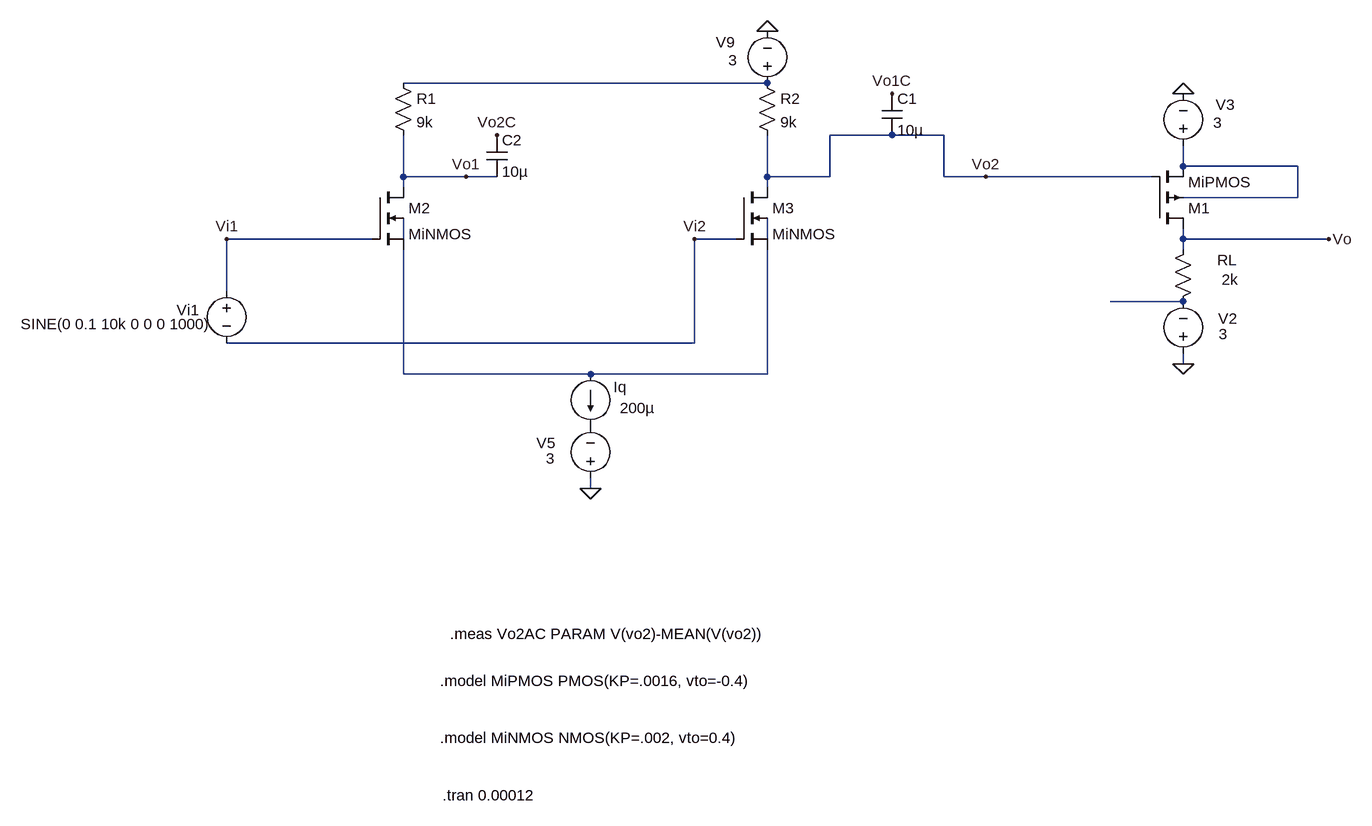
[diagram p0: schematic Draft1.asc]
Draft1.asc, the LTspice schematic file:
Version 4
SHEET 1 3032 1048
WIRE 2096 -64 1536 -64
WIRE 2288 16 2192 16
WIRE 2368 16 2288 16
WIRE 2736 64 2736 32
WIRE 2912 64 2736 64
WIRE 1536 80 1536 16
WIRE 1632 80 1536 80
WIRE 1680 80 1632 80
WIRE 2096 80 2096 16
WIRE 2192 80 2192 16
WIRE 2192 80 2096 80
WIRE 2368 80 2368 16
WIRE 2432 80 2368 80
WIRE 2688 80 2432 80
WIRE 1536 96 1536 80
WIRE 2096 96 2096 80
WIRE 2912 112 2912 64
WIRE 2912 112 2736 112
WIRE 1488 176 1264 176
WIRE 1536 176 1536 144
WIRE 2048 176 1984 176
WIRE 2096 176 2096 144
WIRE 2736 176 2736 160
WIRE 2960 176 2736 176
WIRE 2736 192 2736 176
WIRE 1264 256 1264 176
WIRE 2736 272 2624 272
WIRE 1984 336 1984 176
WIRE 1984 336 1264 336
WIRE 2736 368 2736 352
WIRE 1536 384 1536 192
WIRE 1824 384 1536 384
WIRE 2096 384 2096 192
WIRE 2096 384 1824 384
WIRE 1824 560 1824 544
FLAG 2736 368 0
FLAG 2736 -48 0
FLAG 1824 560 0
FLAG 2096 -144 0
FLAG 1632 80 Vo1
FLAG 2432 80 Vo2
FLAG 2960 176 Vo
FLAG 1984 176 Vi2
FLAG 1264 176 Vi1
FLAG 2288 -48 Vo1C
FLAG 1680 16 Vo2C
DATAFLAG 2640 272 ""
DATAFLAG 1392 176 ""
DATAFLAG 1664 384 ""
SYMBOL voltage 2736 368 M180
WINDOW 0 54 70 Left 2
WINDOW 3 55 46 Left 2
SYMATTR InstName V2
SYMATTR Value 3
SYMBOL res 2752 176 M0
WINDOW 0 -67 32 Left 2
WINDOW 3 -69 62 Left 2
SYMATTR InstName RL
SYMATTR Value 2k
SYMBOL voltage 2736 48 M180
WINDOW 0 50 79 Left 2
WINDOW 3 46 51 Left 2
SYMATTR InstName V3
SYMATTR Value 3
SYMBOL pmos4 2688 160 M180
SYMATTR InstName M1
SYMATTR Value MiPMOS
SYMBOL voltage 1264 240 R0
WINDOW 0 -77 45 Left 2
WINDOW 3 -317 67 Left 2
WINDOW 123 0 0 Left 0
WINDOW 39 0 0 Left 0
SYMATTR InstName Vi1
SYMATTR Value SINE(0 0.1 10k 0 0 0 1000)
SYMBOL voltage 1824 560 R180
WINDOW 0 54 70 Left 2
WINDOW 3 55 46 Left 2
SYMATTR InstName V5
SYMATTR Value 3
SYMBOL nmos4 1488 96 R0
SYMATTR InstName M2
SYMATTR Value MiNMOS
SYMBOL current 1824 384 R0
WINDOW 0 35 20 Left 2
WINDOW 3 45 52 Left 2
WINDOW 123 0 0 Left 0
WINDOW 39 0 0 Left 0
SYMATTR InstName Iq
SYMATTR Value 200µ
SYMBOL res 1520 -80 R0
SYMATTR InstName R1
SYMATTR Value 9k
SYMBOL voltage 2096 -48 R180
WINDOW 0 50 79 Left 2
WINDOW 3 46 51 Left 2
SYMATTR InstName V9
SYMATTR Value 3
SYMBOL nmos4 2048 96 R0
SYMATTR InstName M3
SYMATTR Value MiNMOS
SYMBOL res 2080 -80 R0
SYMATTR InstName R2
SYMATTR Value 9k
SYMBOL cap 2272 -48 R0
SYMATTR InstName C1
SYMATTR Value 10µ
SYMBOL cap 1664 16 R0
SYMATTR InstName C2
SYMATTR Value 10µ
TEXT 1596 1032 Left 2 !.tran 0.00012
TEXT 1592 856 Left 2 !.model MiPMOS PMOS(KP=.0016, vto=-0.4)
TEXT 1592 944 Left 2 !.model MiNMOS NMOS(KP=.002, vto=0.4)
TEXT 1608 784 Left 2 !.meas Vo2AC PARAM V(vo2)-MEAN(V(vo2))

The netlist it stands for:
* Draft1.asc
V2 0 N005 3
RL Vo N005 2k
V3 N002 0 3
M1 Vo Vo2 N002 N002 MiPMOS
Vi1 Vi1 Vi2 SINE(0 0.1 10k 0 0 0 1000)
V5 0 P001 3
M2 Vo1 Vi1 N006 N003 MiNMOS
Iq N006 P001 200µ
R1 N001 Vo1 9k
V9 N001 0 3
M3 Vo2 Vi2 N006 N004 MiNMOS
R2 N001 Vo2 9k
C1 Vo1C Vo2 10µ
C2 Vo2C Vo1 10µ
.model NMOS NMOS
.model PMOS PMOS
.lib standard.mos
.tran 0.00012
.model MiPMOS PMOS(KP=.0016, vto=-0.4)
.model MiNMOS NMOS(KP=.002, vto=0.4)
.meas Vo2AC PARAM V(vo2)-MEAN(V(vo2))
.backanno
.end